# Altium schematic sheet Sheet1.SchDoc
size A4; SheetNumber: 1; SheetTotal: 1
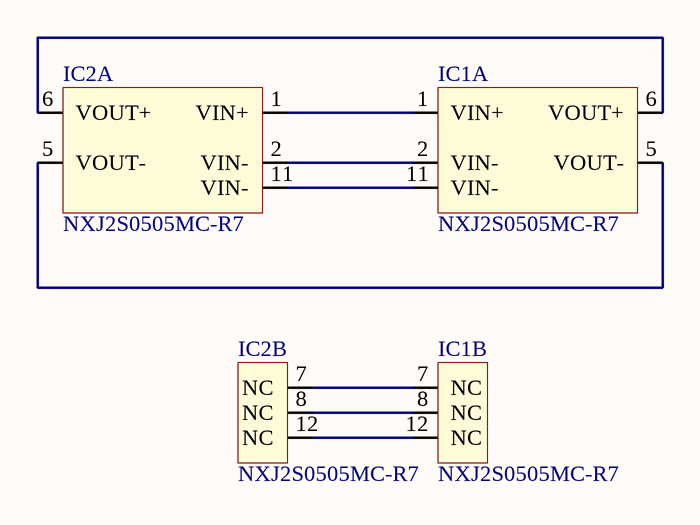
[diagram p0: Sheet1.SchDoc]

## Parts
IC1  NXJ2S0505MC-R7  [DCDC]  (parts A,B of 2)
IC2  NXJ2S0505MC-R7  [DCDC]  (parts A,B of 2)

## Nets
NetIC1_1: IC1.1(VIN+) IC2.1(VIN+)
NetIC1_2: IC1.2(VIN-) IC2.2(VIN-)
NetIC1_5: IC1.5(VOUT-) IC2.5(VOUT-)
NetIC1_6: IC1.6(VOUT+) IC2.6(VOUT+)
NetIC1_7: IC1.7(NC) IC2.7(NC)
NetIC1_8: IC1.8(NC) IC2.8(NC)
NetIC1_11: IC1.11(VIN-) IC2.11(VIN-)
NetIC1_12: IC1.12(NC) IC2.12(NC)

## Notes on the sheet
- Title
- Revision:
- Design Engineer:
- Date:
- Project:
- Sheet
- of

## Library data of the parts
IC1 IC2 = NXJ2S0505MC-R7: Isolated DC/DC Converters - SMD 4.5V TO 5.5V IN 5V OUT; Manufacturer: Murata; Value: 2 W; Created from: VStarost; Manufacturer Part Number: NXJ2S0505MC-R7; PartID: 26; Created On: 21.12.2022 14:43:56; ComponentLink1Description: Datasheet; ComponentLink1URL: https://www.murata.com/products/productdata/8807031996446/kdc-nxj2.pdf; Component Type: DC-DC Converter; Device Package: -; Last Updated: 21.12.2022 14:43:56; Mounting Type: SMD; Series: NXJ2; Supplier 1: Digi-Key; Supplier Part Number 1: 811-3818-1-ND; Type: isolated DC-DC Converter; Live Cycle Status: 1; Stock number: not stored